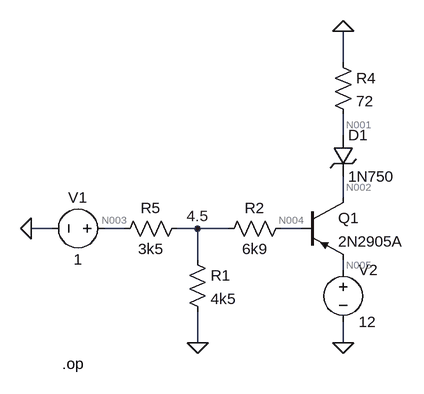
[diagram p0: schematic klucz_6.asc]
klucz_6.asc, the LTspice schematic file:
Version 4
SHEET 1 880 680
WIRE 448 -112 448 -160
WIRE 448 0 448 -32
WIRE 448 96 448 64
WIRE 0 144 -32 144
WIRE 112 144 80 144
WIRE 224 144 192 144
WIRE 272 144 224 144
WIRE 384 144 352 144
WIRE 224 192 224 144
WIRE 448 208 448 192
WIRE 224 320 224 272
WIRE 448 320 448 288
FLAG 224 320 0
FLAG 448 320 0
FLAG 448 -160 0
FLAG -32 144 0
FLAG 224 144 4.5
SYMBOL voltage 96 144 R90
WINDOW 0 -32 56 VBottom 2
WINDOW 3 32 56 VTop 2
WINDOW 123 0 0 Left 0
WINDOW 39 0 0 Left 0
SYMATTR InstName V1
SYMATTR Value 1
SYMBOL res 208 176 R0
SYMATTR InstName R1
SYMATTR Value 4k5
SYMBOL res 368 128 R90
WINDOW 0 0 56 VBottom 2
WINDOW 3 32 56 VTop 2
SYMATTR InstName R2
SYMATTR Value 6k9
SYMBOL res 432 -128 R0
SYMATTR InstName R4
SYMATTR Value 72
SYMBOL pnp 384 96 R0
SYMATTR InstName Q1
SYMATTR Value 2N2905A
SYMBOL voltage 448 192 R0
WINDOW 123 0 0 Left 0
WINDOW 39 0 0 Left 0
SYMATTR InstName V2
SYMATTR Value 12
SYMBOL res 208 128 R90
WINDOW 0 0 56 VBottom 2
WINDOW 3 32 56 VTop 2
SYMATTR InstName R5
SYMATTR Value 3k5
SYMBOL zener 432 0 R0
SYMATTR InstName D1
SYMATTR Value 1N750
SYMATTR Description Diode
SYMATTR Type diode
TEXT 16 352 Left 2 !.op

The netlist it stands for:
* klucz_6.asc
V1 N003 0 1
R1 4.5 0 4k5
R2 N004 4.5 6k9
R4 0 N001 72
Q1 N002 N004 N005 0 2N2905A
V2 N005 0 12
R5 4.5 N003 3k5
D1 N001 N002 1N750
.model D D
.lib standard.dio
.model NPN NPN
.model PNP PNP
.lib standard.bjt
.op
.backanno
.end

* Results of the author's LTspice run, read from the files saved beside the schematic
* Operating Point:
*   V(n003) = 1 V
*   V(4.5) = 2.911 V
*   V(n004) = 11.14 V
*   V(n001) = 7.04 V
*   V(n002) = 11.83 V
*   V(n005) = 12 V
*   Ic(Q1) = -97.77 mA
*   Ib(Q1) = -1.193 mA
*   Ie(Q1) = 98.97 mA
*   I(D1) = -97.77 mA
*   I(R5) = 545.9 µA
*   I(R4) = -97.77 mA
*   I(R2) = 1.193 mA
*   I(R1) = 646.8 µA
*   I(V2) = -98.97 mA
*   I(V1) = 545.9 µA
* From the log:
*   Semiconductor Device Operating Points:
*                           --- Diodes ---
*   Name:      d1
*   Model:    1n750
*   Id:     -9.78e-02
*   Vd:     -4.79e+00
*   Req:     4.59e-01
*   CAP:     5.84e-11
*                           --- Bipolar Transistors ---
*   Name:       q1
*   Model:    2n2905a
*   Ib:      -1.19e-03
*   Ic:      -9.78e-02
*   Vbe:     -8.60e-01
*   Vbc:     -6.92e-01
*   Vce:     -1.68e-01
*   BetaDC:   8.20e+01
*   Gm:       3.51e+00
*   Rpi:      5.38e+01
*   Rx:       1.00e+01
*   Ro:       1.11e+01
*   Cbe:      2.45e-09
*   Cbc:      1.09e-08
*   Cjs:      0.00e+00
*   BetaAC:   1.89e+02
*   Cbx:      0.00e+00
*   Ft:       4.17e+07